# EAGLE design master (EAGLE 5.10)
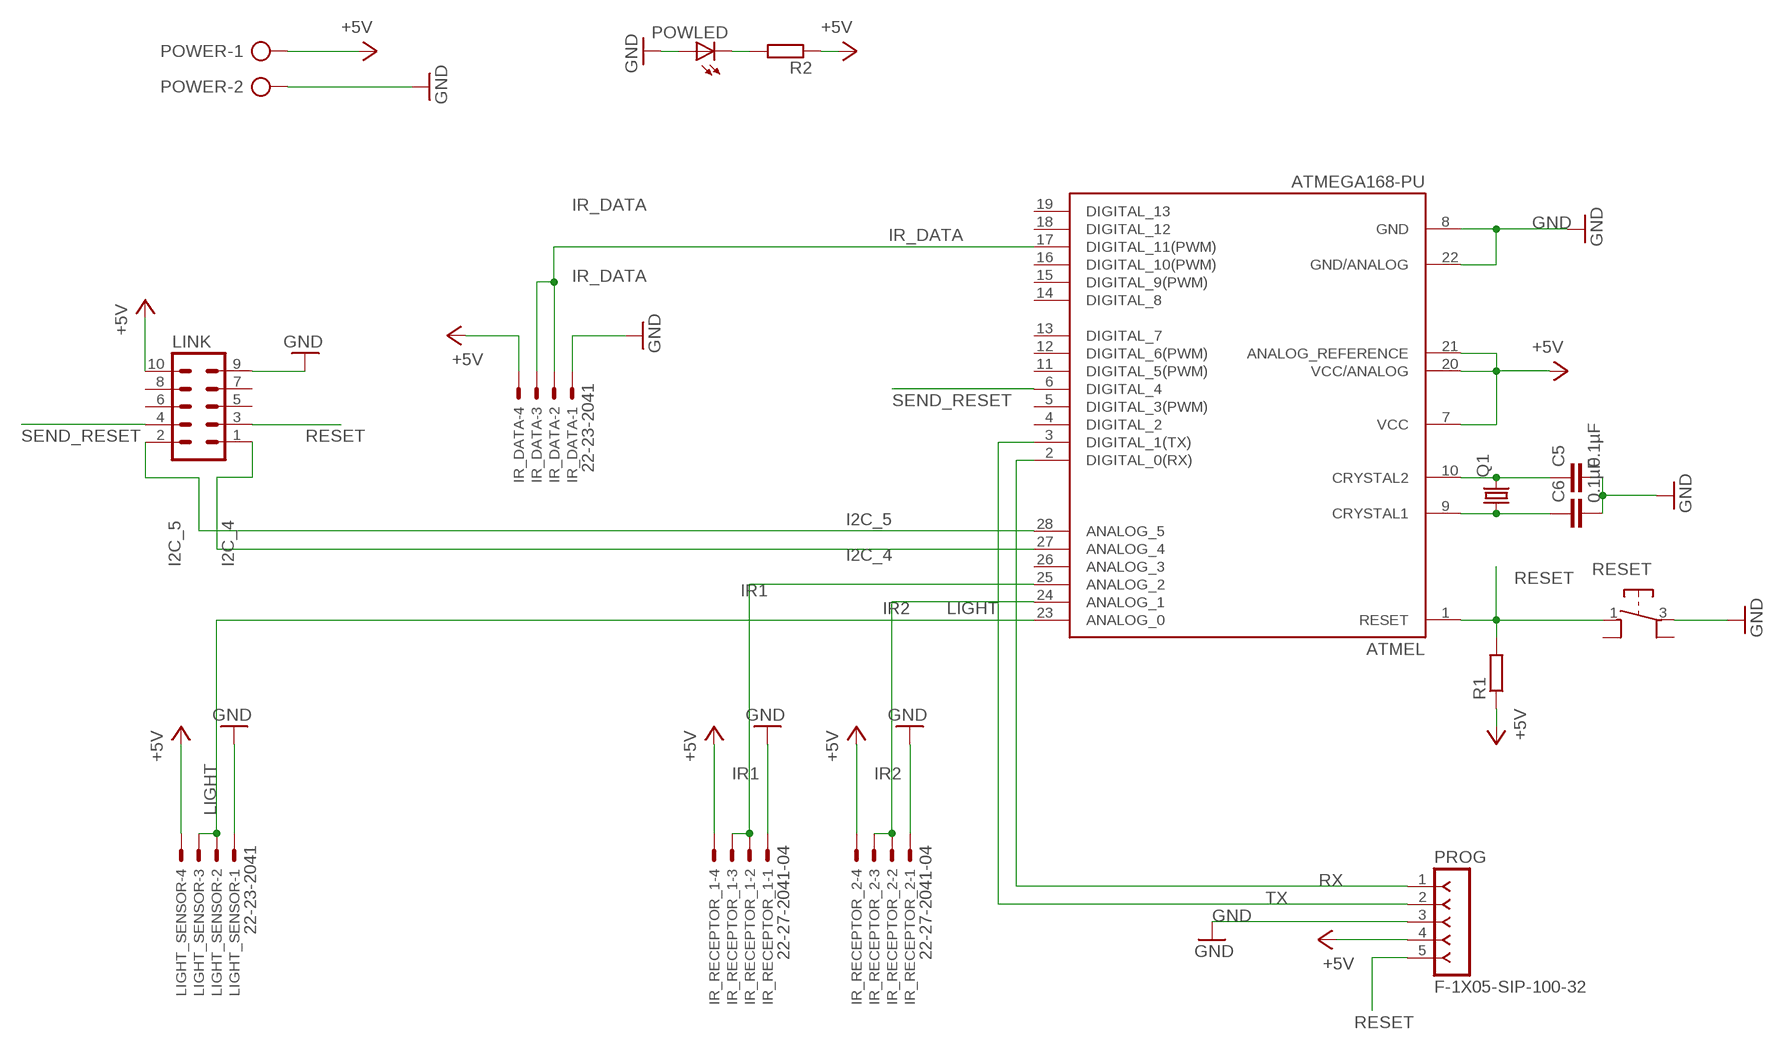
[diagram p0: schematic, sheet 1]

## Parts
ATMEL  ATMEGA168-PU  [DIL28-3]
C5  0.1µF  C-EU050-025X075  [C050-025X075]
C6  0.1µF  C-EU050-025X075  [C050-025X075]
IR_DATA  22-23-2041  [22-23-2041]
IR_RECEPTOR_1  22-27-2041-04  [6410-04]
IR_RECEPTOR_2  22-27-2041-04  [6410-04]
LIGHT_SENSOR  22-23-2041  [22-23-2041]
LINK  ML10  [ML10]
POWER  AK500/2  [AK500/2]
POWLED  LEDCHIP-LED0805  [CHIP-LED0805]
PROG  F-1X05-SIP-100-32  [SIP-100-05-32]
Q1  CRYSTALHC49U70  [HC49U70]
R1  R-EU_0207/10  [0207/10]
R2  R-EU_0204/7  [0204/7]
RESET  BUTTON_6X6_THRU  [6X6_BUTTON_THRU]

## Nets
+5V: ATMEL.7(VCC) ATMEL.20(VCC/ANALOG) ATMEL.21(ANALOG_REFERENCE) IR_DATA.4 IR_RECEPTOR_1.4 IR_RECEPTOR_2.4 LIGHT_SENSOR.4 LINK.10 POWER.1 PROG.4 R1.1 R2.1
GND: ATMEL.8(GND) ATMEL.22(GND/ANALOG) C5.2 C6.2 IR_DATA.1 IR_RECEPTOR_1.1 IR_RECEPTOR_2.1 LIGHT_SENSOR.1 LINK.9 POWER.2 POWLED.A PROG.3 RESET.3(P1)
I2C_4: ATMEL.27(ANALOG_4) LINK.1
I2C_5: ATMEL.28(ANALOG_5) LINK.2
IR1: ATMEL.25(ANALOG_2) IR_RECEPTOR_1.2 IR_RECEPTOR_1.3
IR2: ATMEL.24(ANALOG_1) IR_RECEPTOR_2.2 IR_RECEPTOR_2.3
IR_DATA: ATMEL.17(DIGITAL_11(PWM)) IR_DATA.2 IR_DATA.3
LIGHT: ATMEL.23(ANALOG_0) LIGHT_SENSOR.2 LIGHT_SENSOR.3
N$1: POWLED.C R2.2
N$3: ATMEL.10(CRYSTAL2) C5.1 Q1.2
N$4: ATMEL.9(CRYSTAL1) C6.1 Q1.1
RESET: ATMEL.1(RESET) LINK.3 PROG.5 R1.2 RESET.1(P2)
RX: ATMEL.2(DIGITAL_0(RX)) PROG.1
SEND_RESET: ATMEL.6(DIGITAL_4) LINK.4
TX: ATMEL.3(DIGITAL_1(TX)) PROG.2
Unconnected: ATMEL.4(DIGITAL_2) ATMEL.5(DIGITAL_3(PWM)) ATMEL.11(DIGITAL_5(PWM)) ATMEL.12(DIGITAL_6(PWM)) ATMEL.13(DIGITAL_7) ATMEL.14(DIGITAL_8) ATMEL.15(DIGITAL_9(PWM)) ATMEL.16(DIGITAL_10(PWM)) ATMEL.18(DIGITAL_12) ATMEL.19(DIGITAL_13) ATMEL.26(ANALOG_3) LINK.5 LINK.6 LINK.7 LINK.8 RESET.2 RESET.4(P1)

## Library data of the parts
ATMEL = Arduino-AVR:ATMEGA168-PU
C5 C6 = rcl:C-EU: CAPACITOR, European symbol
IR_DATA LIGHT_SENSOR = con-molex:22-23-2041: .100" (2.54mm) Center Header - 4 Pin; MF: MOLEX; MPN: 22-23-2041; OC_FARNELL: 1462920; OC_NEWARK: 38C0355
IR_RECEPTOR_1 IR_RECEPTOR_2 = con-molex:22-?-04: CONNECTOR wire to board 2.54 mm (.1 inch) pitch header; OC_FARNELL: unknown; OC_NEWARK: unknown
LINK = con-ml:ML10: HARTING; OC_FARNELL: unknown; OC_NEWARK: unknown
POWER = con-ptr500:AK500/2: CONNECTOR; OC_FARNELL: unknown; OC_NEWARK: unknown
POWLED = adafruit:LED: LED OSRAM: - CHIPLED LG R971, LG N971, LY N971, LG Q971, LY Q971, LO R971, LY R971 LH N974, LH R974 LS Q976, LO Q976, LY Q976 LO Q996 - Hyper CHIPLED LW Q18S LB Q993, LB Q99A, LB R99A - SideLED LS A670, LO A670, LY A670, LG A670, LP A670 LB A673, LV A673, LT A673, LW A673 LH A674 LY A675 LS A676, LA A676, LO A676, LY A676, LW A676 LS A679, LY A679, LG A679 - Hyper Micro SIDELED® LS Y876, LA Y876, LO Y876, LY Y876 LT Y87S - SmartLED LW L88C, LW L88S LB L89C, LB L89S, LG L890 LS L89K, LO L89K, LY L89K LS L896, LA L896, LO L896, LY L896 - TOPLED LS T670, LO T670, LY T670, LG T670, LP T670 LSG T670, LSP T670, LSY T670, LOP T670, LYG T670 LG T671, LOG T671, LSG T671 LB T673, LV T673, LT T673, LW T673 LH T674 LS T676, LA T676, LO T676, LY T676, LB T676, LH T676, LSB T676, LW T676 LB T67C, LV T67C, LT T67C, LS T67K, LO T67K, LY T67K, LW E67C LS E67B, LA E67B, LO E67B, LY E67B, LB E67C, LV E67C, LT E67C LW T67C LS T679, LY T679, LG T679 LS T770, LO T770, LY T770, LG T770, LP T770 LB T773, LV T773, LT T773, LW T773 LH T774 LS E675, LA E675, LY E675, LS T675 LS T776, LA T776, LO T776, LY T776, LB T776 LHGB T686 LT T68C, LB T68C - Hyper Mini TOPLED® LB M676 - Mini TOPLED Santana® LG M470 LS M47K, LO M47K, LY M47K Source: http://www.osram.convergy.de/
PROG = con-headers-jp:F-1X05-: FEMALE HEADER
Q1 = crystal:CRYSTAL: CRYSTAL; OC_FARNELL: unknown; OC_NEWARK: unknown
R1 R2 = rcl:R-EU_: RESISTOR, European symbol
RESET = 0-svo:BUTTON_6X6_*

## Board
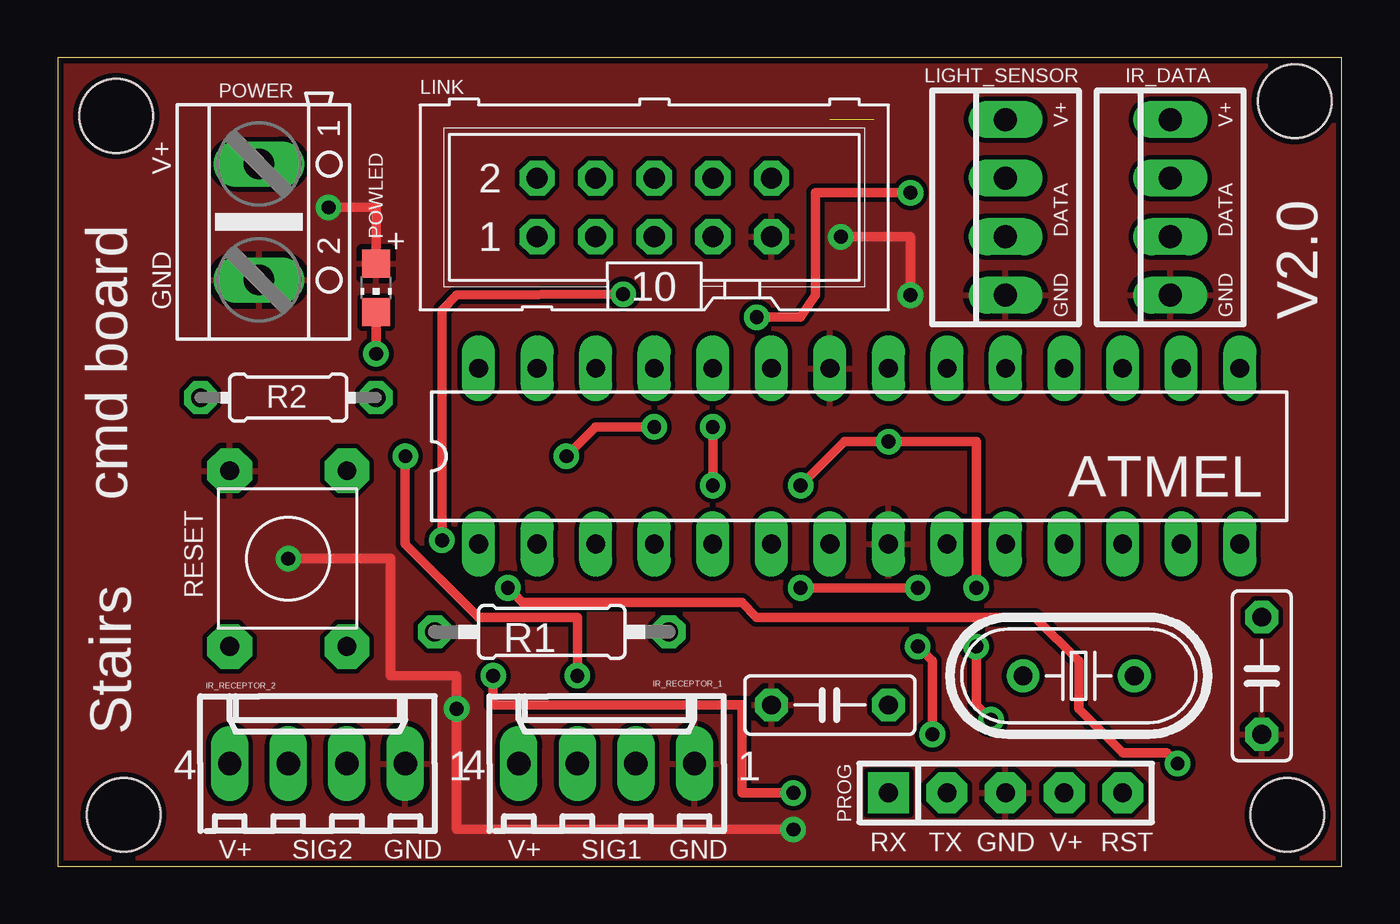
[diagram p1: board, top side]
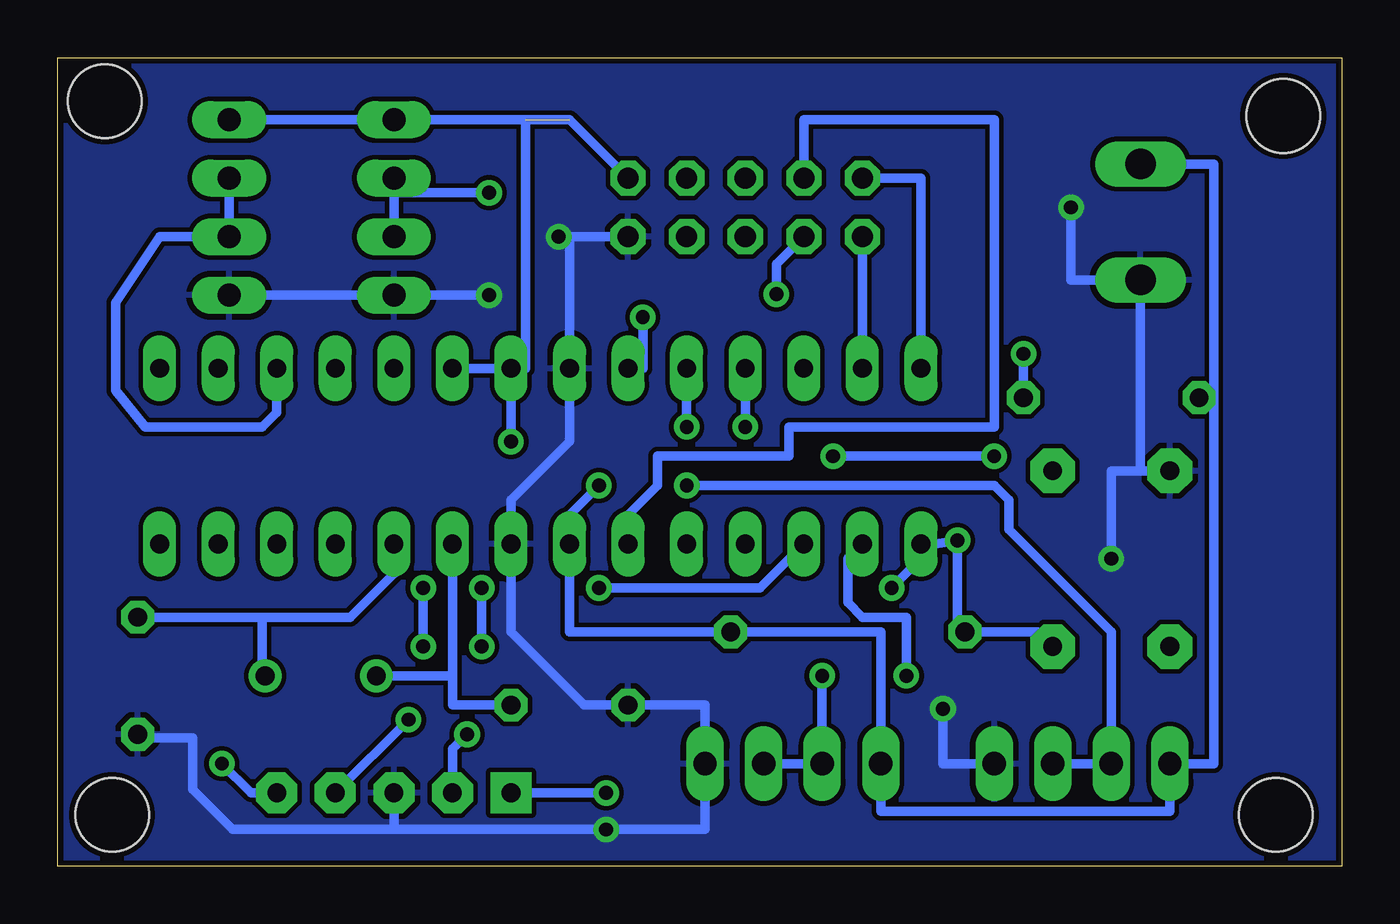
[diagram p2: board, bottom side, seen from below]

Size 55.7 x 35.07 mm. Coordinates in mm from the lower left corner, seen from the top.
Outline: 0,0 55.7,0 55.7,35.07 0,35.07 0,0
Copper layers (1*16): Top 0.035mm / dielectric 1.5mm / Bottom 0.035mm
Design rules "SparkFun": minimum track width 8mil, minimum drill 20mil, track to track 8mil, track to pad 8mil, pad to pad 8mil, via to via 8mil, smd to smd 8mil, copper to edge 10mil, drill to drill 8mil, minimum pad ring 12mil, minimum via ring 10mil, stop-mask expansion 4mil, vias tented up to drill 25mil, thermal gap 10mil
Holes 3.2 mm at 2.54,32.54 53.66,33.18 53.34,2.22 2.86,2.22

### Footprints (pad centres in the part's own frame; a part is rotated, then mirrored left to right if it is on the bottom)
DIL28-3 = drill 0.813 long: 1 -16.51,-3.81; 2 -13.97,-3.81; 3 -11.43,-3.81; 4 -8.89,-3.81; 5 -6.35,-3.81; 6 -3.81,-3.81; 7 -1.27,-3.81; 8 1.27,-3.81; 9 3.81,-3.81; 10 6.35,-3.81; 11 8.89,-3.81; 12 11.43,-3.81; 13 13.97,-3.81; 14 16.51,-3.81; 15 16.51,3.81; 16 13.97,3.81; 17 11.43,3.81; 18 8.89,3.81; 19 6.35,3.81; 20 3.81,3.81; 21 1.27,3.81; 22 -1.27,3.81; 23 -3.81,3.81; 24 -6.35,3.81; 25 -8.89,3.81; 26 -11.43,3.81; 27 -13.97,3.81; 28 -16.51,3.81
C050-025X075 = drill 0.813 octagon: 1 -2.54,0; 2 2.54,0
22-23-2041 = drill 1 long: 1 -3.81,0; 2 -1.27,0; 3 1.27,0; 4 3.81,0
6410-04 = drill 1.016 long: 1 3.81,0; 2 1.27,0; 3 -1.27,0; 4 -3.81,0
ML10 = drill 0.914 octagon: 1 -5.08,-1.27; 2 -5.08,1.27; 3 -2.54,-1.27; 4 -2.54,1.27; 5 0,-1.27; 6 0,1.27; 7 2.54,-1.27; 8 2.54,1.27; 9 5.08,-1.27; 10 5.08,1.27
AK500/2 = drill 1.321 long: 1 -2.515,0; 2 2.515,0
CHIP-LED0805 = smd 1.2 x 1.2: A 0,-1.05; C 0,1.05
SIP-100-05-32 = drill 0.813 pad 1.778 square: 1 -5.08,0 | drill 0.813 pad 1.778 octagon: 2 -2.54,0; 3 0,0; 4 2.54,0; 5 5.08,0
HC49U70 = drill 0.813 round: 1 -2.413,0; 2 2.413,0
0207/10 = drill 0.813 octagon: 1 -5.08,0; 2 5.08,0
0204/7 = drill 0.813 octagon: 1 -3.81,0; 2 3.81,0
6X6_BUTTON_THRU = drill 0.813 pad 1.93 octagon: 1 -2.54,3.81; 2 -2.54,-3.81; 3 2.54,-3.81; 4 2.54,3.81

### Placement (x,y rotation side)
ATMEL  34.77,17.78 0 top
C5  52.23,8.26 270 top
C6  33.5,6.98 180 top
IR_DATA  48.26,28.58 90 top
IR_RECEPTOR_1  23.81,4.45 0 top
IR_RECEPTOR_2  11.27,4.45 0 top
LIGHT_SENSOR  41.12,28.58 90 top
LINK  25.88,28.58 0 top
POWER  8.73,27.94 270 top
POWLED  13.81,25.08 180 top
PROG  41.12,3.17 0 top
Q1  44.29,8.26 0 top
R1  21.43,10.16 180 top
R2  10,20.32 0 top
RESET  10,13.33 180 top

### Tracks (layer width: path | path; a pad name or v marks a point on that pad's centre or on a via)
+5V  (via drill 0.6)  (1 unrouted)
  Top 0.406: v32.23,16.51 34.13,18.42 v36.04,18.42 39.85,18.42 v39.85,12.06 | v40.48,6.35 39.85,6.98 v39.85,9.53
  Bottom 0.406: IR_DATA.4 LIGHT_SENSOR.4 33.5,32.38 LINK.10 | ATMEL.21 ATMEL.20 | ATMEL.21 35.4,21.59 35.4,32.38 | POWER.1 5.56,30.46 5.56,20.32 | 5.56,20.32 R2.1 | 5.56,20.32 5.56,4.45 IR_RECEPTOR_2.4 7.46,2.38 20,2.38 IR_RECEPTOR_1.4 20,10.16 R1.1 33.5,10.16 ATMEL.7 33.5,15.24 v32.23,16.51 | v36.04,18.42 ATMEL.21 | v40.48,6.35 PROG.4 | v39.85,12.06 v39.85,9.53
GND  (via drill 0.6)
  Top 0.406: v33.97,27.31 36.99,27.31 v36.99,24.77 | v11.75,28.58 13.81,28.58 POWLED.A | v10,13.33 14.45,13.33 14.45,8.26 17.3,8.26 v17.3,6.83 17.3,1.59 v31.91,1.59
  Bottom 0.406: 33.5,27.31 LINK.9 | 33.5,27.31 v33.97,27.31 | v36.99,24.77 LIGHT_SENSOR.1 IR_DATA.1 | 33.5,27.31 ATMEL.22 33.5,18.42 36.04,15.88 ATMEL.8 36.04,10.16 32.86,6.98 C6.2 27.62,6.98 IR_RECEPTOR_1.1 27.62,1.59 v31.91,1.59 41.12,1.59 | v11.75,28.58 11.75,25.43 POWER.2 8.73,17.15 RESET.3 10,17.15 v10,13.33 | v17.3,6.83 17.3,4.45 IR_RECEPTOR_2.1 | 41.12,1.59 PROG.3 | 41.12,1.59 48.1,1.59 49.85,3.33 49.85,5.56 52.07,5.56 C5.2
  pour Bottom: 0,35.08 55.72,35.08 55.72,0 0,0
  pour Top: 0,35.08 55.72,35.08 55.72,0 0,0
I2C_4
  Bottom 0.406: ATMEL.27 LINK.1
I2C_5
  Bottom 0.406: LINK.2 18.26,29.85 ATMEL.28
IR1  (via drill 0.6)
  Top 0.406: v25.88,19.05 23.34,19.05 v22.07,17.78 | v15.08,17.78 15.08,13.97 18.26,10.79 22.54,10.79 v22.54,8.26
  Bottom 0.406: IR_RECEPTOR_1.2 IR_RECEPTOR_1.3 v22.54,8.26 | v25.88,19.05 ATMEL.25 | v15.08,17.78 v22.07,17.78
IR2  (via drill 0.6)
  Top 0.406: v28.42,16.51 v28.42,19.05
  Bottom 0.406: IR_RECEPTOR_2.2 IR_RECEPTOR_2.3 10,10.16 14.45,14.61 14.45,15.88 15.08,16.51 v28.42,16.51 | v28.42,19.05 ATMEL.24
IR_DATA
  Bottom 0.406: IR_DATA.3 IR_DATA.2 51.28,27.31 53.18,24.45 53.18,20.64 51.91,19.05 46.83,19.05 46.2,19.69 ATMEL.17
LIGHT  (via drill 0.6)
  Top 0.406: v30.32,23.81 32.23,23.81 32.86,24.77 32.86,29.21 v36.99,29.21
  Bottom 0.406: 41.12,29.21 LIGHT_SENSOR.2 | 41.12,29.21 LIGHT_SENSOR.3 | ATMEL.23 30.32,21.59 v30.32,23.81 | v36.99,29.21 41.12,29.21
N$1  (via drill 0.6)
  Top 0.406: v13.81,22.23 POWLED.C
  Bottom 0.406: R2.2 v13.81,22.23
N$3
  Bottom 0.406: ATMEL.10 41.12,12.7 43.02,10.79 46.83,10.79 | 46.83,10.79 C5.1 | Q1.2 46.83,8.26 46.83,10.79
N$4
  Bottom 0.406: C6.1 38.58,6.98 38.58,8.26 | 38.58,8.26 Q1.1 | 38.58,8.26 ATMEL.9
RESET  (via drill 0.6)
  Top 0.406: v24.53,24.81 17.3,24.77 16.67,24.13 v16.67,14.13 | v19.53,12.06 20.16,11.43 29.69,11.43 30.32,10.79 42.39,10.79 44.29,8.89 44.29,6.83 46.2,4.92 48.1,4.92 v48.58,4.45
  Bottom 0.305: R1.2 16.67,10.48
  Bottom 0.406: RESET.1 13.18,10.16 R1.2 | v19.53,12.06 18.26,13.33 ATMEL.1 17.62,13.97 v16.67,14.13 16.67,10.48 | LINK.3 24.53,26.11 v24.53,24.81 | PROG.5 47.31,3.17 v48.58,4.45
RX  (via drill 0.6)
  Top 0.406: v18.89,8.26 18.89,6.98 29.69,6.98 29.69,3.17 v31.91,3.17
  Bottom 0.406: ATMEL.2 21.43,13.33 21.43,11.43 20.8,10.79 18.89,10.79 v18.89,8.26 | v31.91,3.17 PROG.1
SEND_RESET
  Bottom 0.406: LINK.4 23.34,32.38 15.08,32.38 15.08,19.05 23.97,19.05 23.97,17.78 29.69,17.78 29.69,16.51 30.96,15.24 ATMEL.6
TX  (via drill 0.6)
  Top 0.406: v32.23,12.06 v37.31,12.06 | v37.31,9.53 37.94,8.89 v37.94,5.71
  Bottom 0.406: ATMEL.3 25.24,12.06 v32.23,12.06 | v37.31,12.06 v37.31,9.53 | v37.94,5.71 38.58,5.08 PROG.2

### Text on the board
tNames: V+ | V+ | V+ | V2.0 | DATA | DATA | GND | GND | GND | cmd board | Stairs | V+ | SIG2 | GND | V+ | SIG1 | GND | RX | TX | GND | V+ | RST